# Altium schematic sheet LCD_Init.SchDoc
size A4
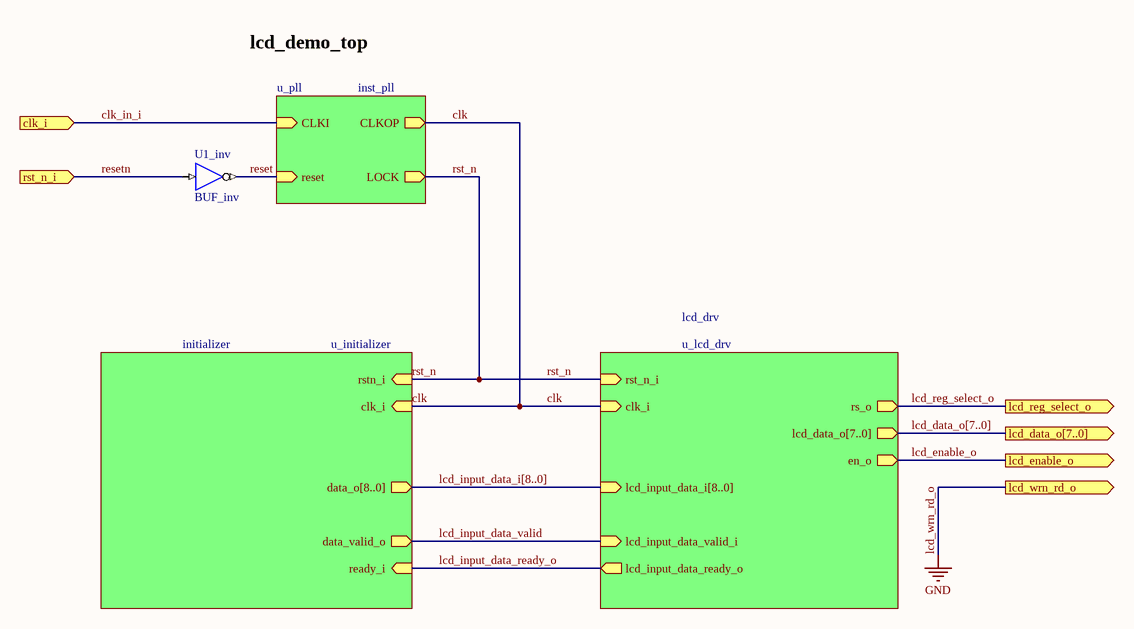
[diagram p0: LCD_Init.SchDoc]

## Parts
U1_inv  BUF_inv

## Sub-sheets
initializer = u_initializer: data_o[8..0] (out), data_valid_o (out), ready_i (in), clk_i (in), rstn_i (in)
lcd_drv = u_lcd_drv: rs_o (out), lcd_data_o[7..0] (out), en_o (out), clk_i (in), lcd_input_data_i[8..0] (in), lcd_input_data_valid_i (in), lcd_input_data_ready_o (out), rst_n_i (in)
u_pll = inst_pll: CLKI (in), CLKOP (out), LOCK (out), reset (in)

## Ports
clk_i (in), lcd_data_o[7..0] (out), lcd_enable_o (out), lcd_reg_select_o (out), lcd_wrn_rd_o (out), rst_n_i (in)

## Nets
lcd_wrn_rd_o: port lcd_wrn_rd_o  [also labelled GND]
clk: sheet lcd_drv/clk_i, sheet initializer/clk_i, sheet u_pll/CLKOP
clk_in_i: port clk_i, sheet u_pll/CLKI
lcd_enable_o: port lcd_enable_o, sheet lcd_drv/en_o
lcd_input_data_ready_o: sheet lcd_drv/lcd_input_data_ready_o, sheet initializer/ready_i
lcd_input_data_valid: sheet lcd_drv/lcd_input_data_valid_i, sheet initializer/data_valid_o
lcd_reg_select_o: port lcd_reg_select_o, sheet lcd_drv/rs_o
reset: U1_inv.O ; sheet u_pll/reset
resetn: U1_inv.I ; port rst_n_i
rst_n: sheet lcd_drv/rst_n_i, sheet initializer/rstn_i, sheet u_pll/LOCK

## Buses and harness runs
bus lcd_data_o[7..0] = port lcd_data_o[7..0] = sheet lcd_drv/lcd_data_o[7..0]
bus lcd_input_data_i[8..0] = sheet initializer/data_o[8..0] = sheet lcd_drv/lcd_input_data_i[8..0]

## Notes on the sheet
- lcd_demo_top

## Library data of the parts
U1_inv = BUF_inv: 1-bit General Purpose (Non-inverting) Buffer